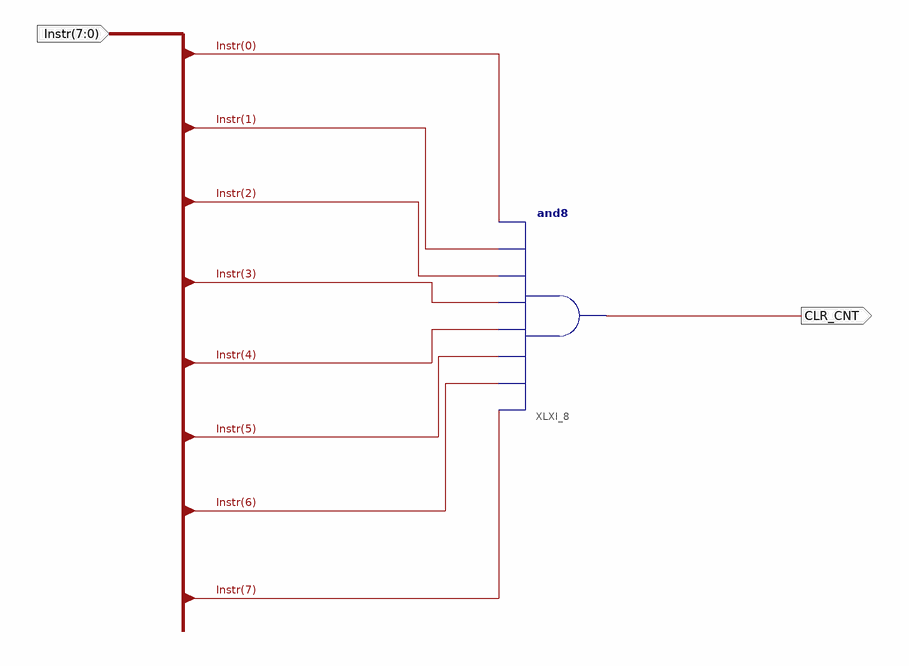
[diagram p0: schematic sheet 1]
// Xilinx ISE schematic instrRST.sch (spartan3e) as structural Verilog: 1 symbols, 2 ports
module instrRST (
  input  [7:0] Instr,
  output CLR_CNT
);

  and XLXI_8 (CLR_CNT, Instr[7], Instr[6], Instr[5], Instr[4], Instr[3], Instr[2], Instr[1], Instr[0]);
endmodule
